# EAGLE design raspberry_pi2 (EAGLE 9.5.2)
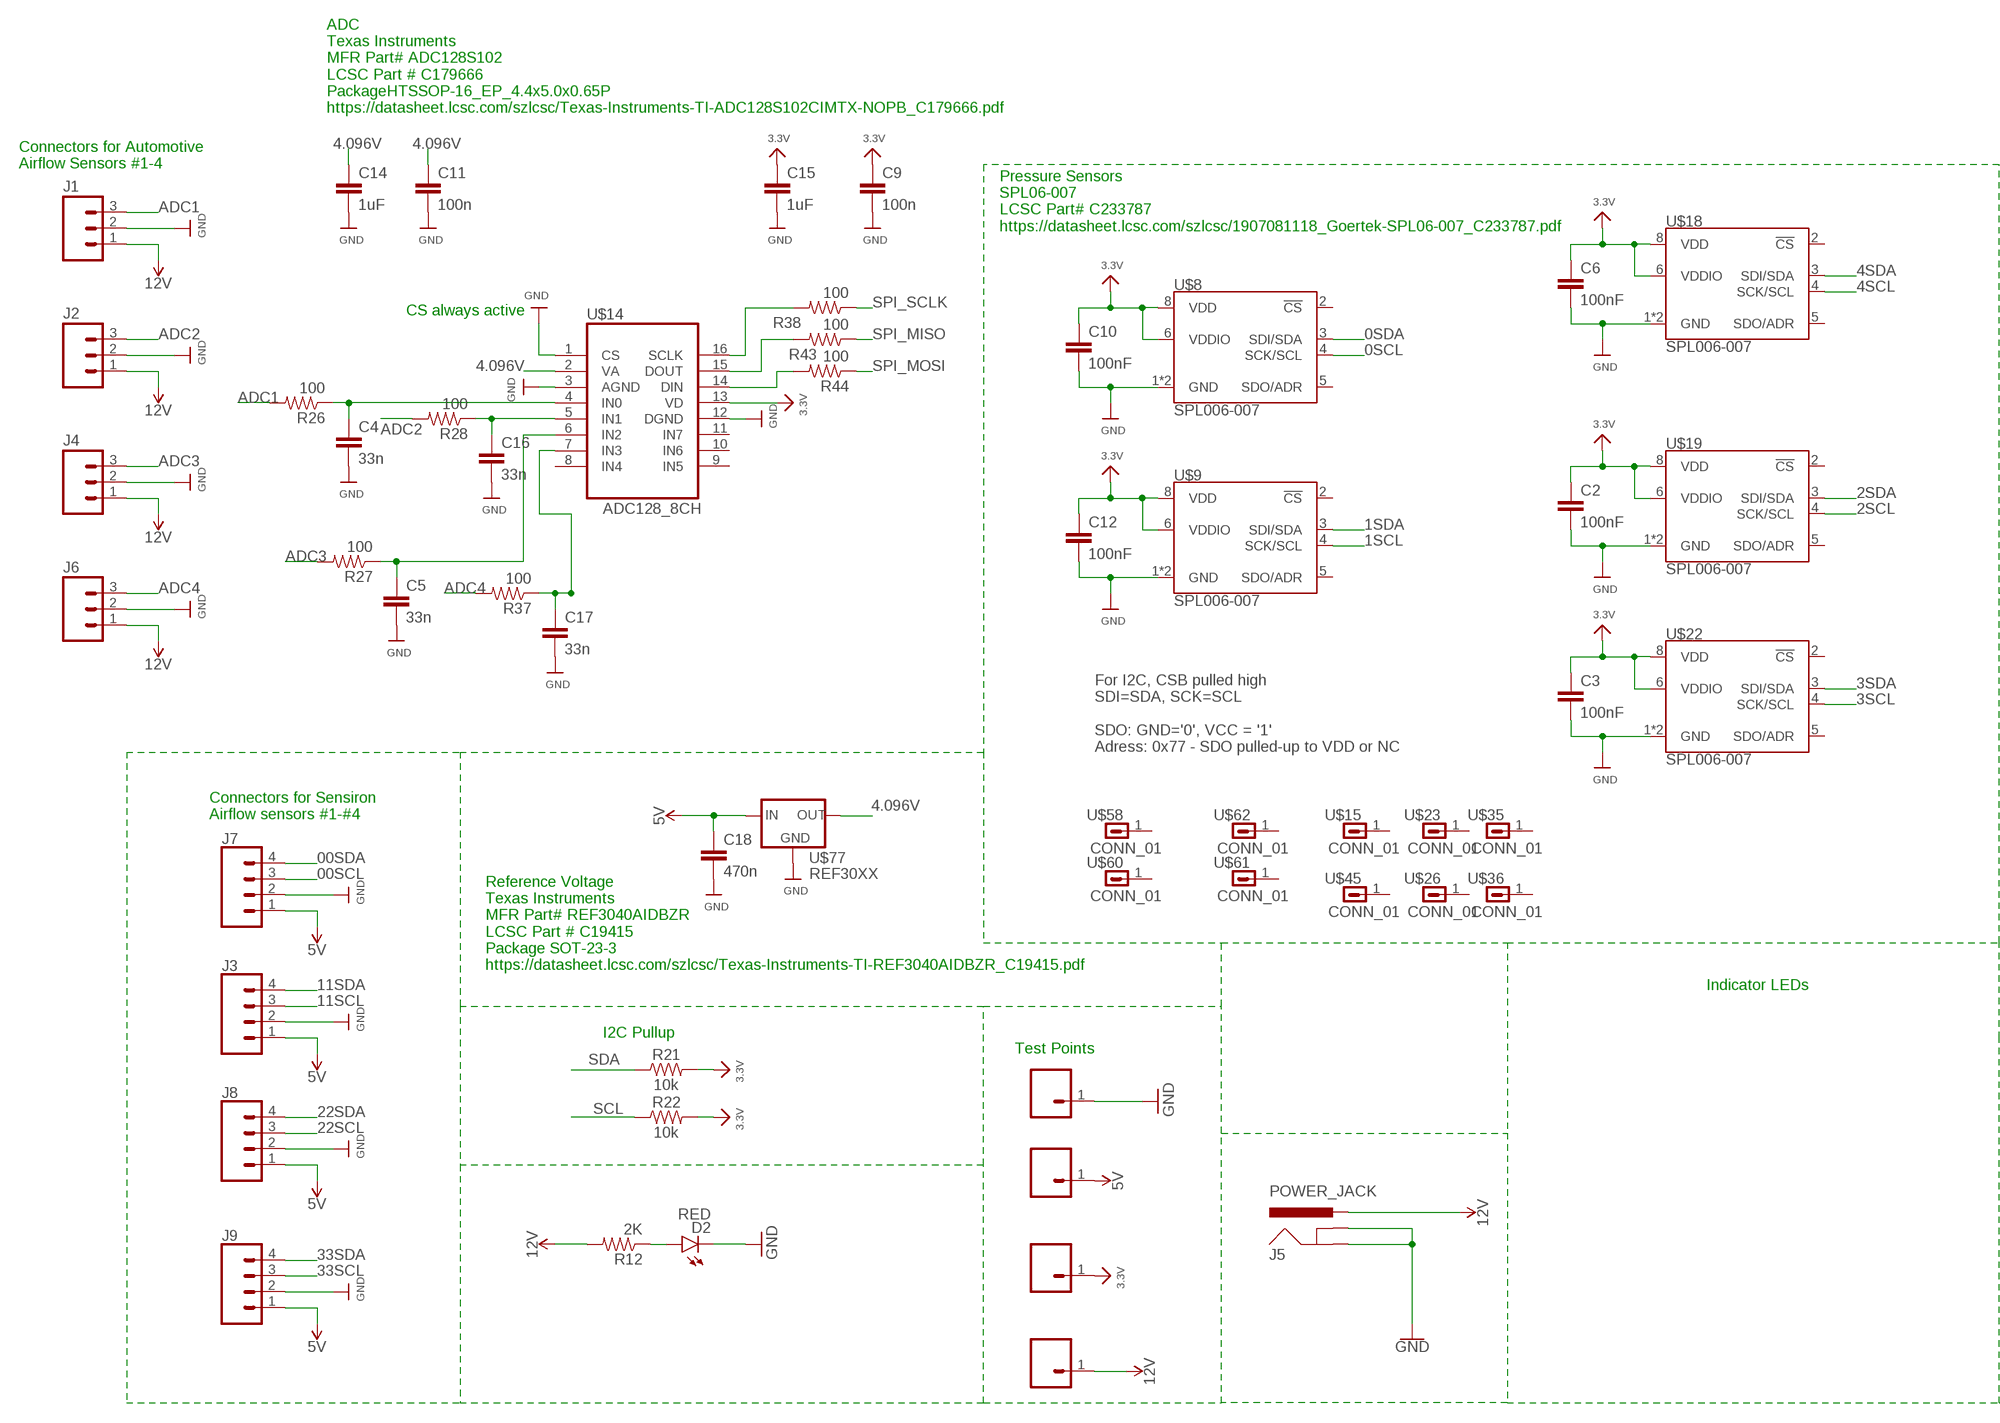
[diagram p0: schematic, sheet 1, part 1 of 2]
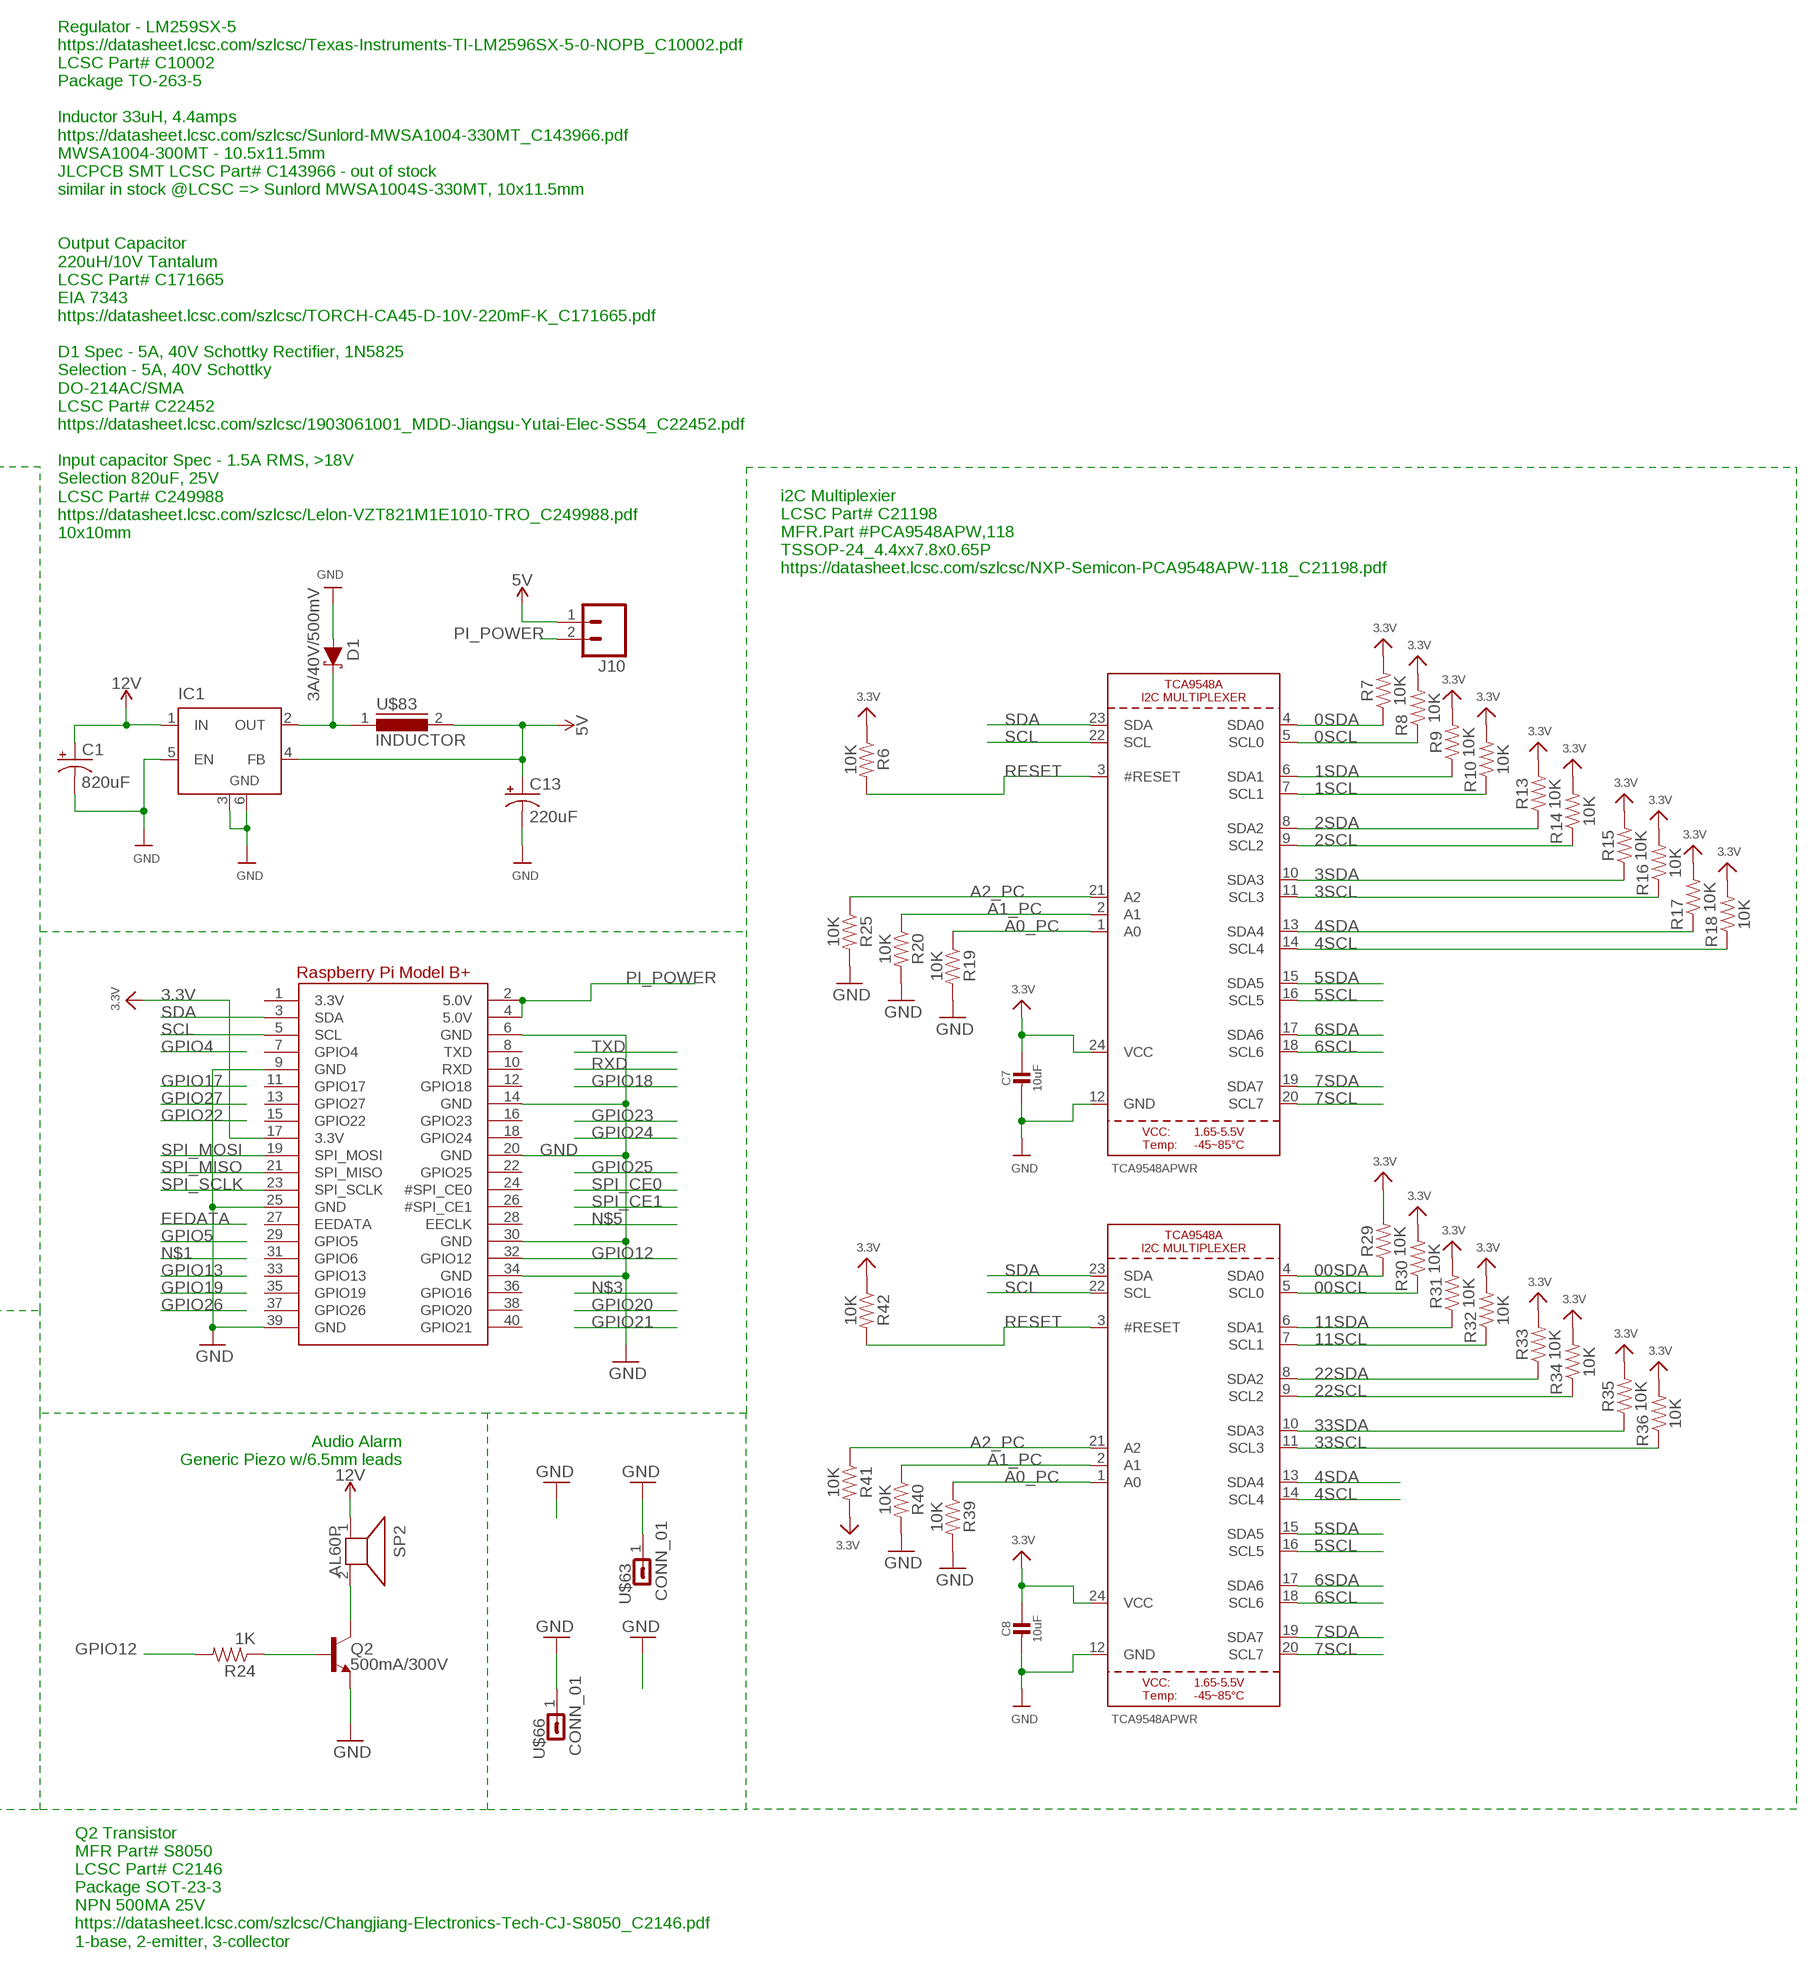
[diagram p1: schematic, sheet 1, part 2 of 2]

## Parts
C1  820uF  560UF-PANASONIC_G-25V-20%  [PANASONIC_G]
C2  100nF  CAP-0805  [0805]
C3  100nF  CAP-0805  [0805]
C4  33n  CAP-0805  [0805]
C5  33n  CAP-0805  [0805]
C6  100nF  CAP-0805  [0805]
C7  10uF  CAP_CERAMIC0805-NOOUTLINE  [0805-NO]
C8  10uF  CAP_CERAMIC0805-NOOUTLINE  [0805-NO]
C9  100n  CAP-0805  [0805]
C10  100nF  CAP-0805  [0805]
C11  100n  CAP-0805  [0805]
C12  100nF  CAP-0805  [0805]
C13  220uF  100UF-POLAR-EIA7343-10V-10%(TANT)  [EIA7343]
C14  1uF  CAP-0805  [0805]
C15  1uF  CAP-0805  [0805]
C16  33n  CAP-0805  [0805]
C17  33n  CAP-0805  [0805]
C18  470n  CAP-0805  [0805]
D1  3A/40V/500mV  DIODE-SCHOTTKY-B340A  [SMA-DIODE]
D2  RED  LED-RED1206  [LED-1206]
IC1  LM2596S  [TO263-5]
J1  M03SCREW  [SCREWTERMINAL-3.5MM-3]
J2  M03SCREW  [SCREWTERMINAL-3.5MM-3]
J3  CONN_043.5MM_RA  [1X04_3.5MM_RA]
J4  M03SCREW  [SCREWTERMINAL-3.5MM-3]
J5  POWER_JACK  [POWER_JACK_PTH]
J6  M03SCREW  [SCREWTERMINAL-3.5MM-3]
J7  CONN_043.5MM_RA  [1X04_3.5MM_RA]
J8  CONN_043.5MM_RA  [1X04_3.5MM_RA]
J9  CONN_043.5MM_RA  [1X04_3.5MM_RA]
J10  CONN_02  [1X02]
Q2  500mA/300V  TRANS_NPN-MMBTA42  [SOT23-3]
R6  10K  0.3OHM-0805-1/8W-1%  [0805]
R7  10K  0.3OHM-0805-1/8W-1%  [0805]
R8  10K  0.3OHM-0805-1/8W-1%  [0805]
R9  10K  0.3OHM-0805-1/8W-1%  [0805]
R10  10K  0.3OHM-0805-1/8W-1%  [0805]
R12  2K  RESISTOR0805-RES  [0805]
R13  10K  0.3OHM-0805-1/8W-1%  [0805]
R14  10K  0.3OHM-0805-1/8W-1%  [0805]
R15  10K  0.3OHM-0805-1/8W-1%  [0805]
R16  10K  0.3OHM-0805-1/8W-1%  [0805]
R17  10K  0.3OHM-0805-1/8W-1%  [0805]
R18  10K  0.3OHM-0805-1/8W-1%  [0805]
R19  10K  0.3OHM-0805-1/8W-1%  [0805]
R20  10K  0.3OHM-0805-1/8W-1%  [0805]
R21  10k  0.3OHM-0805-1/8W-1%  [0805]
R22  10k  0.3OHM-0805-1/8W-1%  [0805]
R24  1K  RESISTOR0805-RES  [0805]
R25  10K  0.3OHM-0805-1/8W-1%  [0805]
R26  100  RESISTOR0805-RES  [0805]
R27  100  RESISTOR0805-RES  [0805]
R28  100  RESISTOR0805-RES  [0805]
R29  10K  0.3OHM-0805-1/8W-1%  [0805]
R30  10K  0.3OHM-0805-1/8W-1%  [0805]
R31  10K  0.3OHM-0805-1/8W-1%  [0805]
R32  10K  0.3OHM-0805-1/8W-1%  [0805]
R33  10K  0.3OHM-0805-1/8W-1%  [0805]
R34  10K  0.3OHM-0805-1/8W-1%  [0805]
R35  10K  0.3OHM-0805-1/8W-1%  [0805]
R36  10K  0.3OHM-0805-1/8W-1%  [0805]
R37  100  RESISTOR0805-RES  [0805]
R38  100  RESISTOR0805-RES  [0805]
R39  10K  0.3OHM-0805-1/8W-1%  [0805]
R40  10K  0.3OHM-0805-1/8W-1%  [0805]
R41  10K  0.3OHM-0805-1/8W-1%  [0805]
R42  10K  0.3OHM-0805-1/8W-1%  [0805]
R43  100  RESISTOR0805-RES  [0805]
R44  100  RESISTOR0805-RES  [0805]
RPI1  MICROBUILDER_RASPBERRYPI_BPLUS_HATNOSLOTS_1  [MICROBUILDER_PI_HAT_NOSLOTS]
SP2  AL60P  [AL60P]
U6  TCA9548APWR  TCA9548A  [TSSOP24]
U7  TCA9548APWR  TCA9548A  [TSSOP24]
U$8  SPL006-007  [LGA-8-2.5X2.0]
U$9  SPL006-007  [LGA-8-2.5X2.0]
U$14  ADC128_8CH  [TSSOP16]
U$15  CONN_01  [1X01-#6_MACHINE]
U$18  SPL006-007  [LGA-8-2.5X2.0]
U$19  SPL006-007  [LGA-8-2.5X2.0]
U$20  CONN_0138MILL  [1X01-40MILL]
U$22  SPL006-007  [LGA-8-2.5X2.0]
U$23  CONN_01  [1X01-#6_MACHINE]
U$26  CONN_01  [1X01-#6_MACHINE]
U$31  CONN_0138MILL  [1X01-40MILL]
U$35  CONN_01  [1X01-#6_MACHINE]
U$36  CONN_01  [1X01-#6_MACHINE]
U$40  CONN_0138MILL  [1X01-40MILL]
U$45  CONN_01  [1X01-#6_MACHINE]
U$58  CONN_01  [1X01-#6_MACHINE]
U$59  CONN_0138MILL  [1X01-40MILL]
U$60  CONN_01  [1X01-#6_MACHINE]
U$61  CONN_01  [1X01-#6_MACHINE]
U$62  CONN_01  [1X01-#6_MACHINE]
U$63  CONN_01  [1X01-#6_MACHINE]
U$66  CONN_01  [1X01-#6_MACHINE]
U$77  REF30XX  [SOT23-3]
U$83  INDUCTOR  [INDUCTOR_10.5X11.5]

## Nets
0SCL: R8.1 U6.5(SCL0) U$8.4(SCK/SCL)
00SCL: J7.3 R30.1 U7.5(SCL0)
0SDA: R7.1 U6.4(SDA0) U$8.3(SDI/SDA)
00SDA: J7.4 R29.1 U7.4(SDA0)
1SCL: R10.1 U6.7(SCL1) U$9.4(SCK/SCL)
1SDA: R9.1 U6.6(SDA1) U$9.3(SDI/SDA)
2SCL: R14.1 U6.9(SCL2) U$19.4(SCK/SCL)
2SDA: R13.1 U6.8(SDA2) U$19.3(SDI/SDA)
3.3V: C2.1 C3.1 C6.1 C7.1 C8.1 C9.1 C10.1 C12.1 C15.1 R6.1 R7.2 R8.2 R9.2 R10.2 R13.2 R14.2 R15.2 R16.2 R17.2 R18.2 R21.2 R22.2 R29.2 R30.2 R31.2 R32.2 R33.2 R34.2 R35.2 R36.2 R41.2 R42.1 RPI1.17(3.3V) U6.24(VCC) U7.24(VCC) U$8.6(VDDIO) U$8.8(VDD) U$9.6(VDDIO) U$9.8(VDD) U$14.13(VD) U$18.6(VDDIO) U$18.8(VDD) U$19.6(VDDIO) U$19.8(VDD) U$20.1 U$22.6(VDDIO) U$22.8(VDD)
3SCL: R16.1 U6.11(SCL3) U$22.4(SCK/SCL)
3SDA: R15.1 U6.10(SDA3) U$22.3(SDI/SDA)
4.096V: C11.1 C14.1 U$14.2(VA) U$77.2(OUT)
4SCL: R18.1 U6.14(SCL4) U7.14(SCL4) U$18.4(SCK/SCL)
4SDA: R17.1 U6.13(SDA4) U7.13(SDA4) U$18.3(SDI/SDA)
5SCL: U6.16(SCL5) U7.16(SCL5)
5SDA: U6.15(SDA5) U7.15(SDA5)
5V: C13.A(+) C18.1 IC1.4(FB) J3.1 J7.1 J8.1 J9.1 J10.1 U$59.1 U$77.1(IN) U$83.2
6SCL: U6.18(SCL6) U7.18(SCL6)
6SDA: U6.17(SDA6) U7.17(SDA6)
7SCL: U6.20(SCL7) U7.20(SCL7)
7SDA: U6.19(SDA7) U7.19(SDA7)
11SCL: J3.3 R32.1 U7.7(SCL1)
11SDA: J3.4 R31.1 U7.6(SDA1)
12V: C1.+ IC1.1(IN) J1.1 J2.1 J4.1 J5.PWR J6.1 R12.2 SP2.1 U$40.1
22SCL: J8.3 R34.1 U7.9(SCL2)
22SDA: J8.4 R33.1 U7.8(SDA2)
33SCL: J9.3 R36.1 U7.11(SCL3)
33SDA: J9.4 R35.1 U7.10(SDA3)
A0_PC: R19.1 R39.1 U6.1(A0) U7.1(A0)
A1_PC: R20.1 R40.1 U6.2(A1) U7.2(A1)
A2_PC: R25.1 R41.1 U6.21(A2) U7.21(A2)
ADC1: J1.3 R26.2
ADC2: J2.3 R28.2
ADC3: J4.3 R27.2
ADC4: J6.3 R37.2
GND: C1.- C2.2 C3.2 C4.2 C5.2 C6.2 C7.2 C8.2 C9.2 C10.2 C11.2 C12.2 C13.C(-) C14.2 C15.2 C16.2 C17.2 C18.2 D1.A D2.C IC1.3(GND) IC1.5(EN) IC1.6(GND) J1.2 J2.2 J3.2 J4.2 J5.GND J5.GNDBREAK J6.2 J7.2 J8.2 J9.2 Q2.2(E) R19.2 R20.2 R25.2 R39.2 R40.2 RPI1.6(GND) RPI1.9(GND) RPI1.14(GND) RPI1.20(GND) RPI1.25(GND) RPI1.30(GND) RPI1.34(GND) RPI1.39(GND) U6.12(GND) U7.12(GND) U$8.1(GND) U$8.7(GND) U$9.1(GND) U$9.7(GND) U$14.1(CS) U$14.3(AGND) U$14.12(DGND) U$18.1(GND) U$18.7(GND) U$19.1(GND) U$19.7(GND) U$22.1(GND) U$22.7(GND) U$31.1 U$63.1 U$66.1 U$77.3(GND)
GPIO12: R24.2 RPI1.32(GPIO12)
N$2: D2.A R12.1
N$9: Q2.3(C) SP2.2
N$10: Q2.1(B) R24.1
N$18: C4.1 R26.1 U$14.4(IN0)
N$19: C5.1 R27.1 U$14.6(IN2)
N$20: C16.1 R28.1 U$14.5(IN1)
N$21: D1.C IC1.2(OUT) U$83.1
N$22: C17.1 R37.1 U$14.7(IN3)
N$23: R38.2 U$14.16(SCLK)
N$24: R43.2 U$14.15(DOUT)
N$25: R44.2 U$14.14(DIN)
PI_POWER: J10.2 RPI1.2(5.0V) RPI1.4(5.0V)
RESET: R6.2 R42.2 U6.3(#RESET) U7.3(#RESET)
SCL: R22.1 RPI1.5(SCL) U6.22(SCL) U7.22(SCL)
SDA: R21.1 RPI1.3(SDA) U6.23(SDA) U7.23(SDA)
SPI_MISO: R43.1 RPI1.21(SPI_MISO)
SPI_MOSI: R44.1 RPI1.19(SPI_MOSI)
SPI_SCLK: R38.1 RPI1.23(SPI_SCLK)
Unconnected: RPI1.1(3.3V) RPI1.7(GPIO4) RPI1.8(TXD) RPI1.10(RXD) RPI1.11(GPIO17) RPI1.12(GPIO18) RPI1.13(GPIO27) RPI1.15(GPIO22) RPI1.16(GPIO23) RPI1.18(GPIO24) RPI1.22(GPIO25) RPI1.24(#SPI_CE0) RPI1.26(#SPI_CE1) RPI1.27(EEDATA) RPI1.28(EECLK) RPI1.29(GPIO5) RPI1.31(GPIO6) RPI1.33(GPIO13) RPI1.35(GPIO19) RPI1.36(GPIO16) RPI1.37(GPIO26) RPI1.38(GPIO20) RPI1.40(GPIO21) U$8.2(!CS) U$8.5(SDO/ADR) U$9.2(!CS) U$9.5(SDO/ADR) U$14.8(IN4) U$14.9(IN5) U$14.10(IN6) U$14.11(IN7) U$15.1 U$18.2(!CS) U$18.5(SDO/ADR) U$19.2(!CS) U$19.5(SDO/ADR) U$22.2(!CS) U$22.5(SDO/ADR) U$23.1 U$26.1 U$35.1 U$36.1 U$45.1 U$58.1 U$60.1 U$61.1 U$62.1

## Notes on the sheet
- ADC
  Texas Instruments
  MFR Part# ADC128S102
  LCSC Part # C179666
  PackageHTSSOP-16_EP_4.4x5.0x0.65P
  https://datasheet.lcsc.com/szlcsc/Texas-Instruments-TI-ADC128S102CIMTX-NOPB_C179666.pdf
- Connectors for Automotive 
  Airflow Sensors #1-4
- Pressure Sensors
  SPL06-007
  LCSC Part# C233787
  https://datasheet.lcsc.com/szlcsc/1907081118_Goertek-SPL06-007_C233787.pdf
- Regulator - LM259SX-5
  https://datasheet.lcsc.com/szlcsc/Texas-Instruments-TI-LM2596SX-5-0-NOPB_C10002.pdf
  LCSC Part# C10002
  Package TO-263-5
  
  Inductor 33uH, 4.4amps
  https://datasheet.lcsc.com/szlcsc/Sunlord-MWSA1004-330MT_C143966.pdf
  MWSA1004-300MT - 10.5x11.5mm
  JLCPCB SMT LCSC Part# C143966 - out of stock
  similar in stock @LCSC => Sunlord MWSA1004S-330MT, 10x11.5mm
  
  
  Output Capacitor
  220uH/10V Tantalum
  LCSC Part# C171665
  EIA 7343
  https://datasheet.lcsc.com/szlcsc/TORCH-CA45-D-10V-220mF-K_C171665.pdf
  
  D1 Spec - 5A, 40V Schottky Rectifier, 1N5825
  Selection - 5A, 40V Schottky
  DO-214AC/SMA
  LCSC Part# C22452
  https://datasheet.lcsc.com/szlcsc/1903061001_MDD-Jiangsu-Yutai-Elec-SS54_C22452.pdf
  
  Input capacitor Spec - 1.5A RMS, >18V
  Selection 820uF, 25V
  LCSC Part# C249988
  https://datasheet.lcsc.com/szlcsc/Lelon-VZT821M1E1010-TRO_C249988.pdf
  10x10mm
- i2C Multiplexier
  LCSC Part# C21198
  MFR.Part #PCA9548APW,118
  TSSOP-24_4.4xx7.8x0.65P
  https://datasheet.lcsc.com/szlcsc/NXP-Semicon-PCA9548APW-118_C21198.pdf
- CS always active
- For I2C, CSB pulled high
  SDI=SDA, SCK=SCL
  
  SDO: GND='0', VCC = '1'
  Adress: 0x77 - SDO pulled-up to VDD or NC
- Connectors for Sensiron
  Airflow sensors #1-#4
- Reference Voltage
  Texas Instruments
  MFR Part# REF3040AIDBZR
  LCSC Part # C19415
  Package SOT-23-3
  https://datasheet.lcsc.com/szlcsc/Texas-Instruments-TI-REF3040AIDBZR_C19415.pdf
- Indicator LEDs
- I2C Pullup
- Test Points
- Audio Alarm
  Generic Piezo w/6.5mm leads
- Q2 Transistor
  MFR Part# S8050
  LCSC Part# C2146
  Package SOT-23-3
  NPN 500MA 25V
  https://datasheet.lcsc.com/szlcsc/Changjiang-Electronics-Tech-CJ-S8050_C2146.pdf
  1-base, 2-emitter, 3-collector

## Library data of the parts
C1 = SparkFun-Capacitors:560UF: 560µF polarized capacitors A capacitor is a passive two-terminal electrical component used to store electrical energy temporarily in an electric field.; PROD_ID: CAP-09983; VALUE: 560uF
C2-C6 C9-C12 C14-C18 = SparkFun-Capacitors:CAP
C7 C8 = microbuilder:CAP_CERAMIC: Ceramic Capacitors For new designs, use the packages preceded by an '_' character since they are more reliable: The following footprints should be used on most boards: _0402 - Standard footprint for regular board layouts _0603 - Standard footprint for regular board layouts _0805 - Standard footprint for regular board layouts _1206 - Standard footprint for regular board layouts For extremely tight-pitch boards where space is at a premium, the following 'micro-pitch' footprints can be used (smaller pads, no silkscreen outline, etc.): _0402MP - Micro-pitch footprint for very dense/compact boards _0603MP - Micro-pitch footprint for very dense/compact boards _0805MP - Micro-pitch footprint for very dense/compact boards _1206MP - Micro-pitch footprint for very dense/compact boards
C13 = th_libraries:100UF-POLAR: 100µF polarized capacitors A capacitor is a passive two-terminal electrical component used to store electrical energy temporarily in an electric field.; PROD_ID: CAP-07890; VALUE: 100uF
D1 = SparkFun-DiscreteSemi:DIODE-SCHOTTKY: Schottky diode A Schottky diode is a semiconductor diode which has a low forward voltage drop and a very fast switching action.; PROD_ID: DIO-09886
D2 = SparkFun-LED:LED-RED: Red SMD LED Used in manufacturing of most products at SparkFun Packages: 0603 - SMD 0603 package [Product Link] <http://docs.avagotech.com/docs/AV02-0551EN> 0603 SMART - SMD 0603 SMART package ( more efficient and expensive)[Product Link] <http://www.osram-os.com/Graphics/XPic2/00077099_0.pdf> 1206 - SMD1206 package [Product Link] <https://www.sparkfun.com/datasheets/DevTools/LilyPad/Q150OVS4.pdff> SparkFun Products: Pro Mini 328 -5V <https://www.sparkfun.com/products/821> RedBoard <https://www.sparkfun.com/products/12757> IOIO-OTG <https://www.sparkfun.com/products/13613>; PROD_ID: DIO-09912
IC1 = linear:LM2596S: STEP-DOWN VOLTAGE REGULATOR
J1 J2 J4 J6 = SparkFun-Connectors:M03: Header 3 Standard 3-pin 0.1" header. Use with straight break away headers (SKU : PRT-00116), right angle break away headers (PRT-00553), swiss pins (PRT-00743), machine pins (PRT-00117), and female headers (PRT-00115). Molex polarized connector foot print use with SKU : PRT-08232 with associated crimp pins and housings.; PROD_ID: CONN-08288
J3 J7-J9 = th_libraries:CONN_04: Multi connection point. Often used as Generic Header-pin footprint for 0.1 inch spaced/style header connections On any of the 0.1 inch spaced packages, you can populate with these: Break Away Headers - Straight <https://www.sparkfun.com/products/116> (PRT-00116) Break Away Male Headers - Right Angle <https://www.sparkfun.com/products/553> (PRT-00553) Female Headers <https://www.sparkfun.com/products/115> (PRT-00115) Break Away Headers - Machine Pin <https://www.sparkfun.com/products/117> (PRT-00117) Break Away Female Headers - Swiss Machine Pin <https://www.sparkfun.com/products/743> (PRT-00743) For SCREWTERMINALS and SPRING TERMINALS visit here: Screw Terimnals on SparkFun.com <https://www.sparkfun.com/search/results?term=Screw+Terminals> (5mm/3.5mm/2.54mm spacing) This device is also useful as a general connection point to wire up your design to another part of your project. Our various solder wires solder well into these plated through hole pads. Hook-Up Wire - Assortment (Stranded, 22 AWG) <https://www.sparkfun.com/products/11375> (PRT-11375) Hook-Up Wire - Assortment (Solid Core, 22 AWG) <https://www.sparkfun.com/products/11367> (PRT-11367) View the entire wire category on our website here <https://www.sparkfun.com/categories/141> Special notes: Molex polarized connector foot print use with SKU : PRT-08231 with associated crimp pins and housings. 1MM SMD Version SKU: PRT-10208
J5 = SparkFun-Connectors:POWER_JACK: Power Jack Connector This is the standard 5.5mm barrel jack for power. The PTH is the most common, proven, reliable, footprint. The Slot footprint only works if the mill layer is transmitted to the PCB fab house so be warned. Here are the connectors we sell at SparkFun: DC Barrel Power Jack/Connector <https://www.sparkfun.com/products/119> (PRT-00119) DC Barrel Power Jack/Connector (SMD) <https://www.sparkfun.com/products/12748> (PRT-12748) DC Barrel Jack Adapter - Breadboard Compatible <https://www.sparkfun.com/products/10811> (PRT-10811) It is used on this SparkFun product (and many, many others): SparkFun RedBoard - Programmed with Arduino <https://www.sparkfun.com/products/12757> (DEV-12757) Also, if you need a mating power supply or connector, please check these out: Wall Adapter Power Supply - 9VDC 650mA <https://www.sparkfun.com/products/298> (TOL-00298) DC Barrel Jack Adapter - Male <https://www.sparkfun.com/products/10287> (PRT-10287); PROD_ID: CONN-08197
J10 = SparkFun-Connectors:CONN_02: Multi connection point. Often used as Generic Header-pin footprint for 0.1 inch spaced/style header connections On any of the 0.1 inch spaced packages, you can populate with these: Break Away Headers - Straight <https://www.sparkfun.com/products/116> (PRT-00116) Break Away Male Headers - Right Angle <https://www.sparkfun.com/products/553> (PRT-00553) Female Headers <https://www.sparkfun.com/products/115> (PRT-00115) Break Away Headers - Machine Pin <https://www.sparkfun.com/products/117> (PRT-00117) Break Away Female Headers - Swiss Machine Pin <https://www.sparkfun.com/products/743> (PRT-00743) For SCREWTERMINALS and SPRING TERMINALS visit here: Screw Terimnals on SparkFun.com <https://www.sparkfun.com/search/results?term=Screw+Terminals> (5mm/3.5mm/2.54mm spacing) This device is also useful as a general connection point to wire up your design to another part of your project. Our various solder wires solder well into these plated through hole pads. Hook-Up Wire - Assortment (Stranded, 22 AWG) <https://www.sparkfun.com/products/11375> (PRT-11375) Hook-Up Wire - Assortment (Solid Core, 22 AWG) <https://www.sparkfun.com/products/11367> (PRT-11367) View the entire wire category on our website here <https://www.sparkfun.com/categories/141> Special notes: Molex polarized connector foot print use with: PRT-08233 with associated crimp pins and housings. 2.54_SCREWTERM for use with PRT-10571. 3.5mm Screw Terminal footprints for PRT-08084 5mm Screw Terminal footprints for use with PRT-08432
Q2 = SparkFun-DiscreteSemi:TRANS_NPN: NPN transistor Current controlled devices typically used to amplify current or used as a switch. BC547 - COM-08928 <http://www.sparkfun.com/products/8928> (TO-92 45V 100mA) (1.Collector 2.Base 3.Emitter) 2N3904 - COM-00521 <http://www.sparkfun.com/products/521> (TO-92 40V 200mA) (1.Emitter 2.Base 3.Collector) P2N2222A - COM-12852 <http://www.sparkfun.com/products/12852> (TO-92 40V 600mA) (1.Collector 2.Base 3.Emitter); PROD_ID: TRANS-09116
R6-R10 R13-R22 R25 R29-R36 R39-R42 = SparkFun-Resistors:0.3OHM: 0.3Ω resistor A resistor is a passive two-terminal electrical component that implements electrical resistance as a circuit element. Resistors act to reduce current flow, and, at the same time, act to lower voltage levels within circuits. - Wikipedia; PROD_ID: RES-11622; VALUE: 0.3
R12 R24 R26-R28 R37 R38 R43 R44 = SparkFun-Passives:RESISTOR: Resistor Basic schematic elements and footprints for 0603, 1206, and PTH resistors.
RPI1 = Adafruit HaD Proto HAT rev A_temp:MICROBUILDER_RASPBERRYPI_BPLUS
SP2 = buzzer:AL60P: SPEAKER Source: Buerklin; OC_FARNELL: unknown; OC_NEWARK: unknown
U6 U7 = microbuilder:TCA9548A: TCA9548A I2C Multiplexer
U$8 U$9 U$18 U$19 U$22 = th_libraries:SPL006-007: Goertek SPL06-007 – Combined Humidity and Pressure Sensor The SPL06-007 is as combined digital humidity, pressure and temperature sensor.. The sensor module is housed in an extremely compact metal-lid LGA package with a footprint of only 2.5×2.0mm² with a height of 0.95mm. . Datasheet <https://datasheet.lcsc.com/szlcsc/1907081118_Goertek-SPL06-007_C233787.pdf>
U$14 = th_libraries:ADC128_8CH: ADC128S102 12-bit, 8 Channel ADC http://www.ti.com/lit/ds/symlink/adc128s102.pdf?HQS=TI-null-null-digikeymode-df-pf-null-wwe&ts=1591294747607 https://www.digikey.com/product-detail/en/texas-instruments/ADC128S102CIMTX-NOPB/296-41184-1-ND/5222639
U$15 U$23 U$26 U$35 U$36 U$45 U$58 U$60-U$63 U$66 = th_libraries:CONN_01: #6 Machine Screw tite - 144mil hole, 256mil diameter
U$20 U$31 U$40 U$59 = th_libraries3:CONN_01: #6 Machine Screw tite - 144mil hole, 256mil diameter
U$77 = th_libraries:REF30XX: Voltage Reference REF3012 - 1.25V REF3020 - 2.048V REF3025 - 2.5V REF3030 - 3.0V REF3033 - 3.3V REF3040 - 4.096V REF3040AIDBZR https://www.digikey.com/product-detail/en/texas-instruments/REF3040AIDBZR/296-35920-1-ND/4135041
U$83 = th_libraries:INDUCTOR

## Net classes
1 highpower: width 0.305 mm, drill 0.483 mm
2 lowpower: width 0.305 mm, drill 0.483 mm

## Board
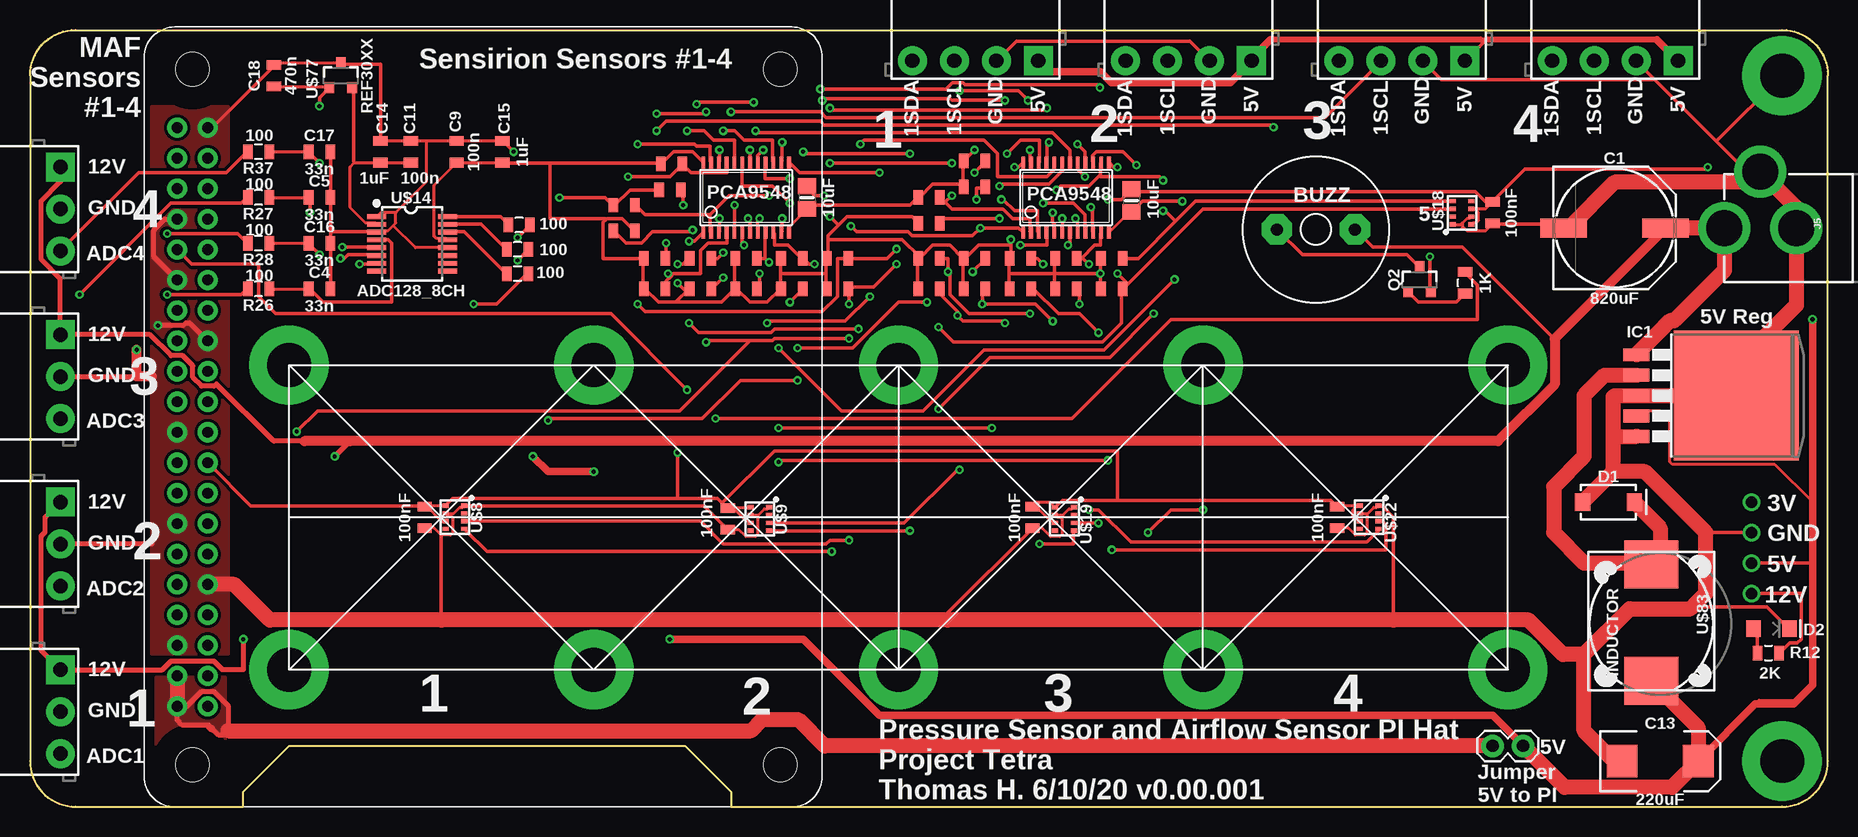
[diagram p2: board, top side]
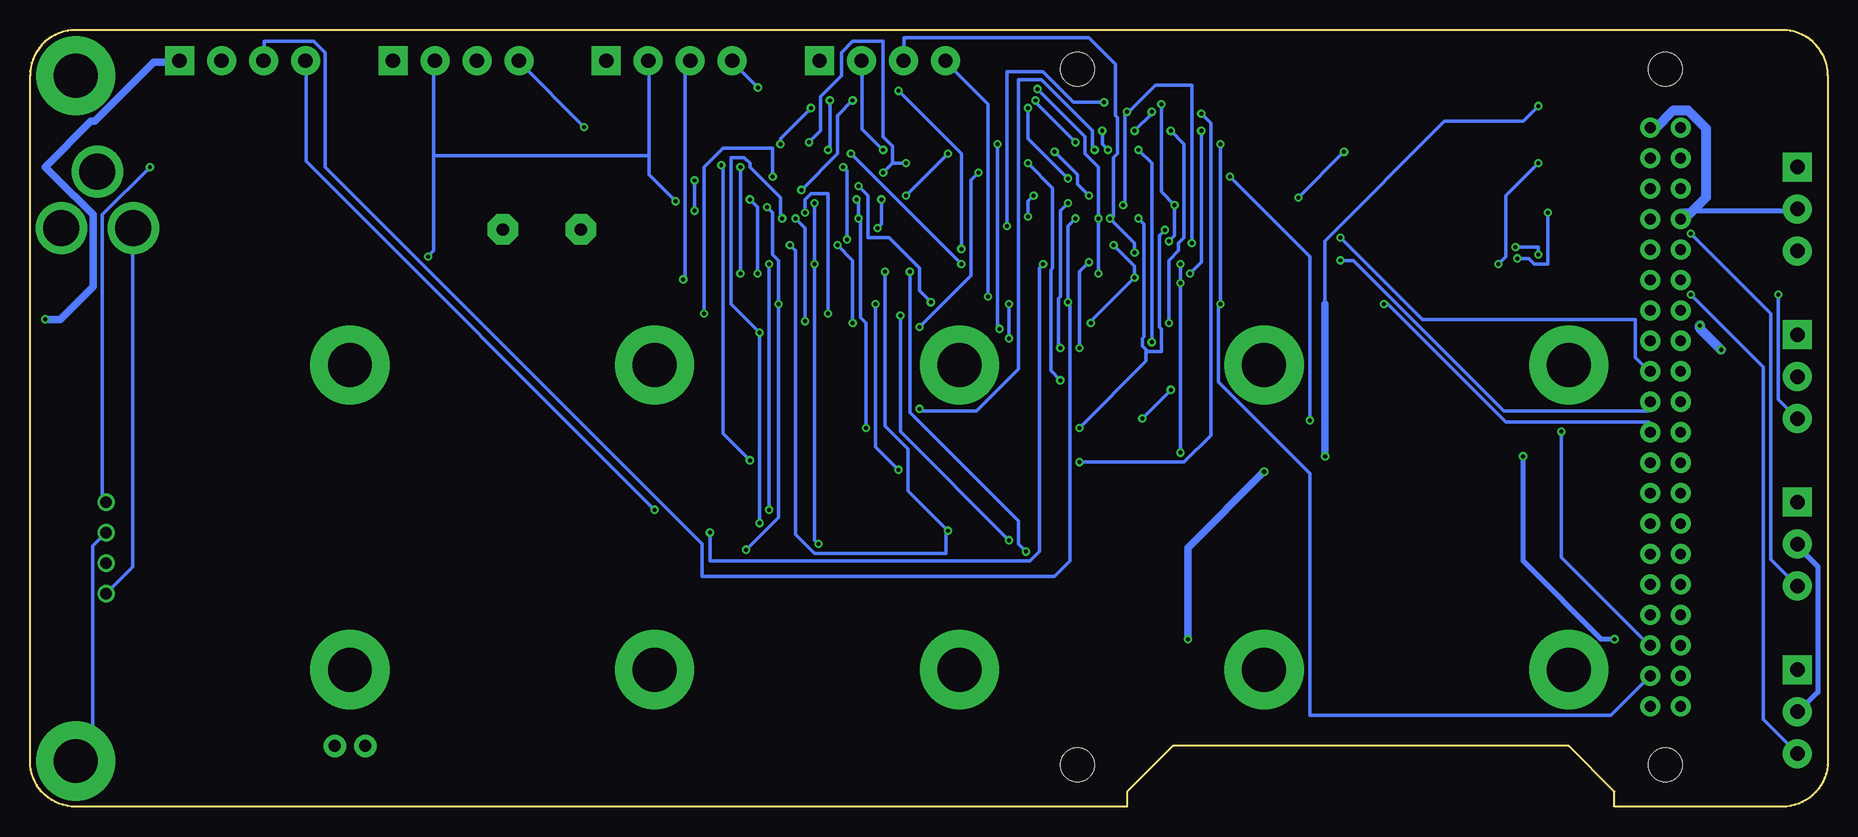
[diagram p3: board, bottom side, seen from below]

Size 149.86 x 64.77 mm. Coordinates in mm from the lower left corner, seen from the top.
Outline: 0,60.96 0,3.81 arc90 3.81,0 17.78,0 17.78,1.27 21.59,5.08 54.61,5.08 58.42,1.27 58.42,0 146.05,0 arc90 149.86,3.81 149.86,60.96 arc90 146.05,64.77 3.81,64.77 arc90 0,60.96
Copper layers (1*16): Top 0.0356mm / dielectric 1.5011mm / Bottom 0.0356mm
Design rules "LaenPCBOrder *": minimum track width 12mil, minimum drill 13mil, track to track 8mil, track to pad 8mil, pad to pad 8mil, via to via 8mil, smd to smd 6mil, copper to edge 15mil, drill to drill 6mil, minimum pad ring 7mil, minimum via ring 7mil, stop-mask expansion 3mil, vias tented up to drill 25mil, thermal gap 10mil

### Footprints (pad centres in the part's own frame; a part is rotated, then mirrored left to right if it is on the bottom)
PANASONIC_G = smd 3.9 x 1.6: + 4.25,0; - -4.25,0
0805 = smd 0.8 x 1.2: 1 -0.9,0; 2 0.9,0
0805-NO = smd 1.3 x 1.5: 1 -0.95,0; 2 0.95,0
EIA7343 = smd 2.55 x 2.7: A 3.17,0; C -3.17,0
SMA-DIODE = smd 1.27 x 1.47: A -2.15,0; C 2.15,0
LED-1206 = smd 1.2 x 1.4: A -1.5,0; C 1.5,0
TO263-5 = smd 1.067 x 2.159: 1 -3.404,-5.791; 2 -1.702,-5.791; 3 0,-5.791; 4 1.702,-5.791; 5 3.404,-5.791 | smd 10.8 x 10.41: 6 0,2.54
SCREWTERMINAL-3.5MM-3 = drill 1.2 pad 2.413 square: 1 0,0 | drill 1.2 pad 2.413: 2 3.5,0; 3 7,0
1X04_3.5MM_RA = drill 1.2 pad 2.413 square: 1 -0.228,0.023 | drill 1.2 pad 2.413: 2 3.272,0.023; 3 6.772,0.023; 4 10.272,0.023
POWER_JACK_PTH = drill 2.997 pad 4.318: GND 0,7.7; GNDBREAK 4.7,10.7; PWR 0,13.7
1X02 = drill 1.016 pad 1.88: 1 0,0; 2 2.54,0
SOT23-3 = smd 0.8 x 0.9: 1 -0.95,-1; 2 0.95,-1; 3 0,1.1
MICROBUILDER_PI_HAT_NOSLOTS = drill 0.9 pad 1.676: 1 8.37,51.23; 2 8.37,53.77; 3 10.91,51.23; 4 10.91,53.77; 5 13.45,51.23; 6 13.45,53.77; 7 15.99,51.23; 8 15.99,53.77; 9 18.53,51.23; 10 18.53,53.77; 11 21.07,51.23; 12 21.07,53.77; 13 23.61,51.23; 14 23.61,53.77; 15 26.15,51.23; 16 26.15,53.77; 17 28.69,51.23; 18 28.69,53.77; 19 31.23,51.23; 20 31.23,53.77; 21 33.77,51.23; 22 33.77,53.77; 23 36.31,51.23; 24 36.31,53.77; 25 38.85,51.23; 26 38.85,53.77; 27 41.39,51.23; 28 41.39,53.77; 29 43.93,51.23; 30 43.93,53.77; 31 46.47,51.23; 32 46.47,53.77; 33 49.01,51.23; 34 49.01,53.77; 35 51.55,51.23; 36 51.55,53.77; 37 54.09,51.23; 38 54.09,53.77; 39 56.63,51.23; 40 56.63,53.77 | hole 2.8: 3.5,3.5; 3.5,52.5; 61.5,52.5; 61.5,3.5
AL60P = drill 1.016 pad 2.54 octagon: 1 -3.251,0; 2 3.251,0
TSSOP24 = smd 0.305 x 0.991: 1 -3.575,-2.918; 2 -2.925,-2.918; 3 -2.275,-2.918; 4 -1.625,-2.918; 5 -0.975,-2.918; 6 -0.325,-2.918; 7 0.325,-2.918; 8 0.975,-2.918; 9 1.625,-2.918; 10 2.275,-2.918; 11 2.925,-2.918; 12 3.575,-2.918; 13 3.575,2.918; 14 2.925,2.918; 15 2.275,2.918; 16 1.625,2.918; 17 0.975,2.918; 18 0.325,2.918; 19 -0.325,2.918; 20 -0.975,2.918; 21 -1.625,2.918; 22 -2.275,2.918; 23 -2.925,2.918; 24 -3.575,2.918
LGA-8-2.5X2.0 = smd 0.5 x 0.35: 1 0.771,0.975; 2 0.771,0.325; 3 0.771,-0.325; 4 0.771,-0.975; 5 -0.779,-0.975; 6 -0.779,-0.325; 7 -0.779,0.325; 8 -0.779,0.975
TSSOP16 = smd 0.4 x 1.6: 1 -2.225,-2.85; 2 -1.575,-2.85; 3 -0.925,-2.85; 4 -0.275,-2.85; 5 0.375,-2.85; 6 1.025,-2.85; 7 1.675,-2.85; 8 2.325,-2.85; 9 2.325,3.05; 10 1.675,3.05; 11 1.025,3.05; 12 0.375,3.05; 13 -0.275,3.05; 14 -0.925,3.05; 15 -1.575,3.05; 16 -2.225,3.05
1X01-#6_MACHINE = drill 3.658 pad 6.604: 1 0,0
1X01-40MILL = drill 0.965 pad 1.397: 1 0,0
INDUCTOR_10.5X11.5 = smd 4 x 4.5: 1 -4.975,-0.75; 2 4.725,-0.75

### Placement (x,y rotation side)
C1  132.08,48.26 0 top
C2  83.57,24.13 270 top
C3  108.97,24.13 270 top
C4  24.13,43.18 0 top
C5  24.13,50.8 0 top
C6  121.92,49.53 270 top
C7  91.82,50.55 270 top
C8  64.77,50.8 270 top
C9  35.56,54.61 90 top
C10  32.89,24.13 270 top
C11  31.75,54.61 90 top
C12  58.17,24 270 top
C13  135.89,3.81 0 top
C14  29.21,54.61 90 top
C15  39.37,54.61 90 top
C16  24.13,46.99 0 top
C17  24.13,54.61 0 top
C18  20.32,60.96 90 top
D1  131.57,25.4 0 top
D2  145.16,14.86 0 top
IC1  139.7,34.29 270 top
J1  2.54,11.43 270 top
J2  2.54,25.4 270 top
J3  83.82,62.23 180 top
J4  2.54,39.37 270 top
J5  154.94,48.26 90 top
J6  2.54,53.34 270 top
J7  119.38,62.23 180 top
J8  101.6,62.23 180 top
J9  137.16,62.23 180 top
J10  124.46,5.08 180 top
Q2  115.82,43.94 0 top
R6  74.93,48.64 0 top
R7  74.93,43.18 180 top
R8  74.93,45.72 180 top
R9  78.74,43.18 180 top
R10  78.74,45.72 180 top
R12  144.91,12.83 0 top
R13  82.55,43.18 180 top
R14  82.55,45.72 180 top
R15  86.36,43.18 180 top
R16  86.36,45.72 180 top
R17  90.17,43.18 180 top
R18  90.17,45.72 180 top
R19  78.74,51.69 180 top
R20  74.93,50.8 180 top
R21  67.31,45.72 180 top
R22  67.31,43.18 180 top
R24  119.63,43.69 90 top
R25  78.74,53.85 180 top
R26  19.05,43.18 180 top
R27  19.05,50.8 180 top
R28  19.05,46.99 180 top
R29  52.07,43.18 180 top
R30  52.07,45.72 180 top
R31  55.88,43.18 180 top
R32  55.88,45.72 180 top
R33  59.69,43.18 180 top
R34  59.69,45.72 180 top
R35  63.5,45.72 180 top
R36  63.5,43.18 180 top
R37  19.05,54.61 180 top
R38  40.77,48.51 180 top
R39  53.34,51.44 180 top
R40  49.53,50.16 180 top
R41  53.47,53.59 180 top
R42  49.53,48.01 180 top
R43  40.64,46.48 180 top
R44  40.64,44.45 180 top
RPI1  66.04,0 90 top
SP2  107.19,48.13 180 top
U6  86.36,50.8 0 top
U7  59.69,50.8 0 top
U$8  35.43,24.13 0 top
U$9  60.83,24 0 top
U$14  31.75,46.99 270 top
U$15  46.99,36.83 0 top
U$18  119.38,49.53 180 top
U$19  86.23,24 0 top
U$20  143.51,25.4 270 top
U$22  111.63,24.13 0 top
U$23  21.59,11.43 0 top
U$26  123.19,36.83 0 top
U$31  143.51,22.86 270 top
U$35  21.59,36.83 0 top
U$36  123.19,11.43 0 top
U$40  143.51,17.78 270 top
U$45  46.99,11.43 0 top
U$58  97.79,36.83 0 top
U$59  143.51,20.32 0 top
U$60  97.79,11.43 0 top
U$61  72.39,36.83 0 top
U$62  72.39,11.43 0 top
U$63  146.05,3.81 0 top
U$66  146.05,60.96 270 top
U$77  25.91,60.96 0 top
U$83  135.89,15.24 270 top

### Tracks (layer width: path | path; a pad name or v marks a point on that pad's centre or on a via)
0SCL  (via drill 0.33)
  Top 0.305: v66.83,21.27 38.1,21.27 36.35,23.02 U$8.4 | R8.1 76.52,45.72 v76.52,44.61 76.68,44.61 76.68,42.7 78.26,41.12 v83.34,41.12 | v85.25,49.53 85.25,48.74 85.41,48.58 85.41,47.94 U6.5
  Bottom 0.305: v66.83,21.27 67.47,21.91 67.47,23.81 76.52,32.86 v76.52,44.61 | v85.25,49.53 85.25,50.64 84.77,51.12 83.34,51.12 v83.34,41.12
00SCL  (via drill 0.33)
  Top 0.305: v58.74,50.16 58.74,47.94 U7.5 | v53.02,46.99 53.02,45.72 R30.1 | v58.42,57.94 65.88,57.94 66.36,57.47 107.95,57.47 112.55,62.07 J7.3
  Bottom 0.305: v58.74,50.16 58.58,50.32 58.58,57.63 58.34,57.86 | 58.34,57.86 56.04,60.17 53.02,60.17 v53.02,46.99 | v58.42,57.94 58.34,57.86
0SDA  (via drill 0.33)
  Top 0.305: v68.26,22.23 66.68,22.23 66.36,21.91 57.79,21.91 55.88,23.81 36.35,23.81 U$8.3 | R7.1 75.88,43.18 75.88,42.7 77.31,41.27 v77.31,40.96 77.79,40.48 81.12,40.48 v81.28,40.32 | v82.55,46.83 84.77,46.83 84.77,47.78 U6.4
  Bottom 0.305: v68.26,22.23 77.31,31.27 v77.31,40.96 | v82.55,46.83 81.28,45.56 v81.28,40.32
00SDA  (via drill 0.33)
  Top 0.305: 53.42,44.21 53.02,43.81 53.02,43.18 R29.1 | 53.42,44.21 53.66,44.45 55.88,44.45 55.88,46.35 56.52,46.99 58.1,46.99 58.1,47.78 U7.4 | v53.18,44.45 53.42,44.21 | v52.23,56.36 53.02,57.15 65.88,57.15 66.2,56.83 103.5,56.83 v103.66,56.67
  Bottom 0.305: v53.18,44.45 52.23,45.4 v52.23,56.36 | v103.66,56.67 109.06,62.07 J7.4
1SCL  (via drill 0.33)
  Top 0.305: v73.34,23.02 61.75,23.02 U$9.4 | v78.58,44.61 79.69,45.72 R10.1 | v86.52,46.83 86.68,46.83 86.68,47.78 U6.7
  Bottom 0.305: v78.58,44.61 78.58,31.75 76.68,29.84 76.68,26.35 v73.34,23.02 73.5,23.02 73.5,21.11 84.45,21.11 86.04,22.7 86.04,46.35 v86.52,46.83
1SDA  (via drill 0.33)
  Top 0.305: v77.47,28.1 77.31,28.1 72.87,23.65 61.75,23.65 U$9.3 | R9.1 79.38,43.18 v79.38,41.91 83.82,41.91 v85.25,40.48 | v86.04,49.05 86.04,47.94 U6.6
  Bottom 0.305: v77.47,28.1 79.38,30 v79.38,41.91 | v86.04,49.05 85.25,48.26 v85.25,40.48
2SCL  (via drill 0.33)
  Top 0.305: v84.14,21.91 87,21.91 87,23.02 U$19.4 | v84.45,45.24 83.98,45.72 R14.1 | v84.45,50.32 87,50.32 87.95,49.37 87.95,47.94 U6.9
  Bottom 0.305: v84.14,21.91 84.45,22.23 v84.45,45.24 v84.45,50.32
2SDA  (via drill 0.33)
  Top 0.305: v89.06,23.65 87.15,23.65 U$19.3 | v89.06,39.53 87.47,41.12 85.72,41.12 83.66,43.18 R13.1 | v87.15,49.05 87.31,49.05 87.31,47.94 U6.8
  Bottom 0.305: v89.06,23.65 v89.06,39.53 91.44,41.91 91.44,54.13 90.33,54.13 89.85,53.66 89.85,53.34 87.31,50.8 87.31,49.21 v87.15,49.05
3.3V  (via drill 0.33)
  Top 0.254: U$14.13 34.68,47.38 33.86,47.38 33.67,47.58 33.67,51.82 C9.1 C15.1 | U$18.6 120.65,49.85 | 120.65,49.85 121.34,49.85 C6.1 | U$18.8 120.3,48.7 120.55,48.7 120.74,48.89 120.74,49.52 120.65,49.61 120.65,49.85 | C3.1 109.04,25.1 110.49,25.1 | 110.49,25.1 U$22.8 | U$22.6 110.71,23.95 110.47,23.95 110.27,24.14 110.27,24.77 110.49,24.98 110.49,25.1 | U$19.6 85.31,23.82 85.07,23.82 83.82,25.07 | 83.82,25.07 83.82,25.4 85.03,25.4 U$19.8 | C2.1 83.78,25.03 83.82,25.07 | U$9.8 58.24,24.98 C12.1 58.59,24.9 59.67,23.82 59.91,23.82 U$9.6 | C10.1 32.97,25.1 33.02,25.1 | 33.02,25.1 U$8.8 | U$8.6 34.32,23.8 33.02,25.1
  Top 0.305: v139.86,53.34 139.7,53.18 124.62,53.18 121.92,50.48 C6.1 121.6,50.16 120.49,51.28 92.08,51.28 91.92,51.44 C7.1 91.76,51.44 90.96,50.64 v89.85,50.64 | R7.2 73.98,43.18 73.98,45.72 R8.2 | 77.79,45.72 77.79,43.18 R9.2 | 77.79,45.72 76.68,46.83 75.25,46.83 74.14,45.72 R8.2 | 77.79,45.72 R10.2 77.95,45.72 79.06,46.83 81.76,46.83 | v89.22,44.45 89.22,45.72 R18.2 | v89.22,44.45 89.22,43.18 R17.2 | 85.41,44.45 85.41,45.72 R16.2 | 85.41,44.45 85.41,43.18 R15.2 | v82.07,53.34 82.39,53.34 82.71,53.66 U6.24 | 81.76,46.83 81.76,45.72 R14.2 81.6,45.72 81.6,44.45 | 81.76,46.83 v81.76,47.31 | 81.6,44.45 81.6,43.18 R13.2 | 81.6,44.45 85.41,44.45 | 85.41,44.45 v89.22,44.45 | U7.24 56.04,53.82 55.25,54.61 53.66,54.61 52.7,53.66 R41.2 52.55,53.66 43.34,53.66 | 43.34,53.66 39.37,53.66 C15.1 | 58.74,43.18 58.74,45.72 R34.2 | 51.12,45.72 51.12,43.18 R29.2 51.28,43.18 52.39,42.07 53.82,42.07 53.9,42.15 | 53.9,42.15 54.93,43.18 R31.2 54.61,43.02 v53.98,43.66 | v53.98,45.24 54.45,45.24 54.93,45.72 R32.2 | 48.02,48.97 47.78,48.74 47.78,45.72 51.12,45.72 | 48.02,48.97 48.1,49.05 49.37,49.05 50.32,48.1 R42.1 | 51.12,45.72 R30.2 | 58.74,43.18 57.63,42.07 53.98,42.07 53.9,42.15 | 58.74,43.18 R33.2 58.9,43.18 60.01,42.07 61.44,42.07 62.55,43.18 | 62.55,44.45 62.55,45.72 R35.2 | 62.55,44.45 62.55,43.18 | 66.36,44.45 66.36,45.72 R21.2 66.52,45.72 66.52,47.31 | 66.36,44.45 66.36,43.18 R22.2 | 67.39,48.5 66.52,47.62 66.52,47.31 | 67.39,48.5 68.1,49.21 73.5,49.21 73.98,48.74 R6.1 | v66.2,50.96 65.41,50.96 64.77,51.59 C8.1 | 67.39,48.5 v66.68,49.21 | 66.36,44.45 62.55,44.45 | 62.55,43.18 R36.2 | 43.34,53.66 43.34,49.05 47.94,49.05 48.02,48.97
  Top 0.305: 66.52,47.31 72.71,47.31 74.14,45.88 R8.2 | 90.65,25.56 86.04,25.56 85.57,25.08 U$19.8 | 90.65,25.56 108.43,25.56 108.9,25.08 C3.1 | 53.98,25.72 57.31,25.72 57.71,25.32 | 53.98,25.72 35.24,25.72 34.77,25.24 U$8.8 | 57.71,25.32 58.1,24.92 C12.1 | RPI1.17 14.92,28.57 18.42,25.08 32.86,25.08 C10.1 | 90.65,25.56 90.65,29.69 62.07,29.69 57.71,25.32 | 53.98,25.72 v53.98,29.53
  Bottom 0.305: U$20.1 143.83,25.72 143.83,49.37 v139.86,53.34 | v82.07,53.34 81.76,53.02 v81.76,47.31 | v53.98,45.24 v53.98,43.66 v53.98,29.53 | v66.2,50.96 66.68,50.48 v66.68,49.21 | v89.85,50.64 89.22,50.01 v89.22,44.45
3SCL  (via drill 0.33)
  Top 0.305: v88.27,24.77 89.06,24.77 91.76,22.07 111.44,22.07 112.39,23.02 U$22.4 | v88.27,45.24 87.79,45.72 87.63,45.72 | 87.63,45.72 R16.1 87.31,45.72 | 87.63,45.72 88.74,46.83 89.22,46.83 89.22,47.78 U6.11
  Bottom 0.305: v88.27,45.24 v88.27,24.77
3SDA  (via drill 0.33)
  Top 0.305: v90.17,21.43 113.03,21.43 113.03,23.49 112.71,23.81 112.55,23.81 U$22.3 | v87.47,41.91 87.47,43.18 R15.1 | v88.42,50.01 88.58,50.01 88.58,47.94 U6.10
  Bottom 0.305: v90.17,21.43 87.47,24.13 v87.47,41.91 87.47,45.56 87.95,46.04 87.95,49.53 v88.42,50.01
4.096V
  Top 0.254: U$14.2 28.78,48.69 27.96,48.69 26.67,49.98 26.67,53.34 27.04,53.71 C14.1 C11.1
  Top 0.305: U$77.2 26.99,59.85 26.99,53.82 27.04,53.71
4SCL  (via drill 0.33)
  Top 0.305: 95.49,48.82 92.39,45.72 R18.1 | 95.49,48.82 97.16,50.48 118.59,50.48 U$18.4 | v62.71,55.4 62.71,53.82 U7.14 | v66.04,58.9 66.2,59.05 76.68,59.05 76.84,58.9 v81.28,58.9 | v85.57,51.44 85.88,51.75 88.27,51.75 89.14,52.63 | 89.14,52.63 89.22,52.7 89.22,53.66 U6.14 | 95.49,48.82 94.61,49.69 v94.46,49.69 | v94.46,52.23 94.14,52.55 89.22,52.55 89.14,52.63
  Bottom 0.305: v62.71,55.4 66.04,58.74 v66.04,58.9 | v81.28,58.9 82.55,57.63 82.55,54.45 v85.57,51.44 | v94.46,52.23 v94.46,49.69
4SDA  (via drill 0.33)
  Top 0.305: U$18.3 118.59,49.85 97.79,49.85 91.12,43.18 R17.1 | v70.8,52.86 64.13,52.86 63.34,53.66 U7.13 | v75.72,40 76.99,38.73 89.38,38.73 90.96,40.32 90.96,43.18 R17.1 | v90.65,53.34 90.33,53.34 90.01,53.66 U6.13 | v90.65,44.45 91.44,43.66 R17.1
  Bottom 0.305: v70.8,52.86 71.44,52.23 71.44,44.29 v75.72,40 | v90.65,44.45 v90.65,53.34
5SCL  (via drill 0.33)
  Top 0.305: v63.34,52.39 61.28,52.39 61.28,53.66 U7.16 | v66.68,58.26 66.83,58.1 84.61,58.1 v84.77,58.26 | v87.31,55.24 87.95,54.61 87.95,53.82 U6.16
  Bottom 0.305: v63.34,52.39 66.68,55.72 v66.68,58.26 | v84.77,58.26 87.31,55.72 v87.31,55.24
5SDA  (via drill 0.33)
  Top 0.305: v57.79,56.36 58.74,56.36 59.53,55.56 61.91,55.56 61.91,53.82 U7.15 | v56.36,57.94 56.2,57.78 v52.23,57.78 | v62.39,28.73 62.55,28.89 v89.85,28.89 | v92.23,53.5 91.12,54.61 88.9,54.61 88.58,54.29 88.58,53.82 U6.15
  Bottom 0.305: v57.79,56.36 56.36,57.78 v56.36,57.94 | v52.23,57.78 51.44,56.99 51.44,30.96 53.66,28.73 v62.39,28.73 | v89.85,28.89 92.08,31.11 92.08,53.34 v92.23,53.5
5V  (via drill 0.35)
  Top 0.254: C13.A 139.38,4.13 143.82,8.57 144.14,8.89 147.32,8.89 148.59,10.16 148.59,20.32 148.59,25.4 145.43,28.56 136.9,28.56 136.7,28.75 136.7,32.2 135.89,33.02 134.34,33.02 IC1.4 | C18.1 24.86,60.06 U$77.1
  Top 0.305: 101.76,62.07 J8.1 | 121.28,63.94 121.14,63.8 | J7.1 119.7,62.23 121.21,63.74 121.14,63.8 | 137.32,62.23 J9.1 | 121,63.94 121.14,63.8 | 20.32,60.01 C18.1 | 148.59,20.32 U$59.1 | v24.13,58.42 24.13,59.13 U$77.1
  Top 0.508: 135.6,63.94 121.28,63.94 | 121,63.94 103.38,63.94
  Top 0.61: 101.76,62.07 100.08,60.39 90.14,60.39 89.25,61.28 84.93,61.28 84.14,62.07 J3.1 | 137.32,62.23 135.6,63.94 | 103.38,63.94 101.83,62.39 J8.1 | C13.A 143.82,8.57 147,8.57 148.59,10.16 v148.59,40.64 | J10.1 121.92,7.62 70.81,7.62 64.46,13.97 v53.34,13.97 | v46.99,27.94 43.18,27.94 v41.91,29.21
  Top 1.27: U$83.2 139.06,6.59 C13.A | 139.38,4.13 136.87,1.62 127.92,1.62 J10.1
  Bottom 0.305: 137.32,62.07 J9.1 | 41.91,41.91 41.91,47.18 31.94,57.15 25.4,57.15 v24.13,58.42
  Bottom 0.61: v148.59,40.64 147.32,40.64 144.57,43.39 144.57,49.36 146.13,50.93 146.18,50.93 148.59,53.34 144.78,57.15 144.47,57.15 139.55,62.07 137.32,62.07 | v53.34,13.97 53.34,21.59 v46.99,27.94 | v41.91,29.21 41.91,41.91
6SCL  (via drill 0.33)
  Top 0.305: v60.01,54.77 60.01,53.82 U7.18 | v60.48,56.36 60.64,56.2 85.25,56.2 86.68,54.77 86.68,53.82 U6.18
  Bottom 0.305: v60.01,54.77 60.48,55.24 v60.48,56.36
6SDA  (via drill 0.33)
  Top 0.305: v61.12,54.77 60.64,54.29 60.64,53.82 U7.17 | v75.72,33.18 80.01,37.46 90.01,37.46 v93.66,41.12 | v87.95,52.55 87.31,53.18 87.31,53.66 U6.17
  Bottom 0.305: v61.12,54.77 61.28,54.93 61.28,56.36 65.56,60.64 67.47,60.64 67.47,36.51 70.96,33.02 75.72,33.02 v75.72,33.18 | v93.66,41.12 93.66,53.34 92.08,54.93 87.95,54.93 v87.95,52.55
7SCL  (via drill 0.33)
  Top 0.305: v54.77,56.36 56.2,56.36 56.99,55.56 58.74,55.56 58.74,53.82 U7.20 | v54.93,40.32 55.72,39.53 61.75,39.53 62.07,39.85 v69.06,39.85 | v69.22,55.24 69.53,55.56 79.53,55.56 80.65,54.45 80.65,52.55 84.77,52.55 85.41,53.18 85.41,53.66 U6.20
  Bottom 0.305: v54.77,56.36 53.66,55.24 53.66,47.47 54.13,46.99 54.13,46.35 54.93,45.56 v54.93,40.32 | v69.06,39.85 69.22,40 v69.22,55.24
7SDA  (via drill 0.33)
  Top 0.305: v63.34,50.32 61.91,51.75 59.37,51.75 59.37,53.66 U7.19 | v63.98,38.26 68.58,38.26 72.39,42.07 v74.77,42.07 | v80.8,51.75 80.96,51.91 84.93,51.91 86.04,53.02 86.04,53.66 U6.19
  Bottom 0.305: v63.34,50.32 63.98,49.69 63.98,42.55 64.13,42.39 64.13,38.42 v63.98,38.26 | v74.77,42.07 75.72,43.02 75.72,44.93 78.26,47.47 80.01,47.47 80.01,50.96 v80.8,51.75
11SCL  (via drill 0.33)
  Top 0.305: v59.85,49.05 60.01,49.05 60.01,47.94 U7.7 | v57.79,46.2 57.31,45.72 R32.1
  Bottom 0.305: v57.79,46.2 57.79,46.99 v59.85,49.05 59.69,49.05 59.53,49.21 59.53,54.13 59.21,54.45 59.21,57.47 59.37,57.63 59.37,61.91 61.59,64.13 76.99,64.13 76.99,62.23 J3.3
11SDA  (via drill 0.33)
  Top 0.305: v59.53,46.83 59.37,46.83 59.37,47.78 U7.6 | v57.79,44.13 56.83,43.18 R31.1 | v61.44,40.32 61.59,40.48 67.94,40.48 v70.01,42.55
  Bottom 0.305: v59.53,46.83 57.79,45.09 v57.79,44.13 61.44,40.48 v61.44,40.32 | v70.01,42.55 70.01,58.58 73.5,62.07 J3.4
12V  (via drill 0.35)
  Top 0.305: 3.48,11.43 J1.1 | U$40.1 147.64,17.78 147.64,13.97 147.32,13.65 146.69,13.65 145.89,12.86 R12.2 | SP2.1 110.49,48.1 111.92,46.67 119.38,46.67 126.84,39.21 127.1,39.03
  Top 0.406: 22.86,30.48 20.32,30.48 15.53,35.27 15.33,35.06 14.29,35.06 13.57,35.79 13.57,36.77 12.74,37.6 11.75,37.6 9.99,39.37 J4.1 2.54,44.06 0.93,45.67 0.93,50.51 2.54,52.12 J6.1 | v17.78,13.97 17.78,11.43 16.05,11.43 15.33,12.15 11.75,12.15 11.03,11.43 J1.1 0.93,13.04 0.93,22.57 1.27,22.91 1.27,24.13 J2.1 | v25.4,29.21 26.67,30.48
  Top 0.813: C1.+ 127.1,39.03 127.1,35.21 122.37,30.48 26.67,30.48 22.86,30.48
  Top 1.27: IC1.1 136.2,39.98 136.2,40.04 136.69,40.53 137.05,40.53 141.24,44.72 J5.PWR C1.+ 135.89,48.26
  Bottom 0.305: U$40.1 141.29,20 141.29,48.26 J5.PWR
  Bottom 0.406: v17.78,13.97 18.89,13.97 25.4,20.48 v25.4,29.21
22SCL  (via drill 0.33)
  Top 0.305: 61.28,45.72 61.28,47.78 U7.9 | R34.1 61.28,45.72 | v61.59,45.4 61.28,45.72 | v62.39,38.26 67.63,33.02 74.45,33.02 79.53,38.1 89.53,38.1 v95.41,43.97
  Bottom 0.305: v61.59,45.4 62.39,44.61 v62.39,38.26 | v95.41,43.97 95.25,44.13 95.25,61.75 94.93,62.07 J8.3
22SDA  (via drill 0.33)
  Top 0.305: v60.8,49.05 60.64,49.05 60.64,47.94 U7.8 | v60.8,44.45 60.8,43.18 R33.1 | 66.01,59.98 v65.88,59.85 76.36,59.85 76.9,60.39 77.76,60.39 77.95,60.2 88.96,60.2 v89.19,59.98
  Bottom 0.305: v60.8,44.45 v60.8,49.05 60.8,53.34 61.91,54.45 61.91,55.88 v65.88,59.85 | v89.19,59.98 91.28,62.07 J8.4
33SCL  (via drill 0.33)
  Top 0.305: v62.71,49.05 62.71,47.94 U7.11 | v63.34,42.07 64.45,43.18 R36.1
  Bottom 0.305: v62.71,49.05 63.34,48.42 v63.34,42.07 63.18,41.91 63.18,20.48 64.45,19.21 93.82,19.21 93.82,21.91 125.25,53.34 125.25,62.86 126.21,63.82 130.33,63.82 130.33,62.23 J9.3
33SDA  (via drill 0.33)
  Top 0.305: U7.10 62.07,47.78 62.07,46.83 63.18,46.83 64.29,45.72 R35.1 64.45,45.72 64.93,45.24 v65.41,45.24 | v93.19,22.86 95.09,24.77 v97.79,24.77
  Bottom 0.305: v65.41,45.24 65.72,44.93 65.72,21.27 66.52,20.48 93.19,20.48 v93.19,22.86 | v97.79,24.77 126.84,53.82 126.84,62.07 J9.4
A0_PC  (via drill 0.33)
  Top 0.305: v54.93,47.15 55.4,47.15 56.04,47.78 U7.1 | v54.45,50.16 54.45,51.44 R39.1 | v78.9,50.64 78.9,51.59 79.53,51.59 R19.1 | U6.1 82.71,47.94 82.39,48.26 v79.22,48.26 78.58,47.62 73.5,47.62 73.18,47.94 68.9,47.94 v68.42,48.42 | v55.56,58.58 55.72,58.74 v60.33,58.74
  Bottom 0.305: v54.93,47.15 54.45,47.62 v54.45,50.16 55.56,51.28 v55.56,58.58 | v79.22,48.26 78.9,48.58 v78.9,50.64 | v60.33,58.74 62.87,58.74 65.41,61.28 68.42,61.28 v68.42,48.42
A1_PC  (via drill 0.33)
  Top 0.305: 56.67,49.37 56.67,47.94 U7.2 | 56.67,49.37 51.28,49.37 50.48,50.16 R40.1 | 76.28,50.4 75.88,50.8 R20.1 | 76.28,50.4 76.84,49.85 81.12,49.85 81.92,49.05 83.34,49.05 83.34,47.94 U6.2 | 56.67,49.37 58.26,50.96 v61.59,50.96 | v64.45,54.61 64.61,54.45 v73.34,54.45 | 76.28,50.4 v76.84,50.96
  Bottom 0.305: v61.59,50.96 62.55,51.91 62.55,52.7 v64.45,54.61 | v76.84,50.96 v73.34,54.45
A2_PC  (via drill 0.33)
  Top 0.305: U7.21 58.1,53.66 58.1,52.86 55.09,52.86 54.45,53.5 R41.1 54.29,53.5 53.34,52.55 v49.85,52.55 | v84.93,55.4 84.77,55.4 84.77,53.82 U6.21 | v78.74,52.86 79.69,53.82 R25.1 | v43.18,32.23 43.34,32.38 56.04,32.38 59.21,35.56 v63.98,35.56 | v76.84,53.66 v66.68,53.66
  Bottom 0.305: v84.93,55.4 83.98,56.36 83.98,59.21 82.23,60.96 82.23,62.86 81.28,63.82 78.74,63.82 78.74,55.88 77.95,55.09 77.95,53.66 | v78.74,52.86 77.95,53.66 | v49.85,52.55 43.18,45.88 v43.18,32.23 | v63.98,35.56 64.77,36.35 64.77,44.77 64.61,44.93 64.61,51.59 v66.68,53.66 | 77.95,53.66 v76.84,53.66
ADC1  (via drill 0.33)
  Top 0.305: v11.43,42.7 17.62,42.7 18.1,43.18 R26.2
  Bottom 0.305: v11.43,42.7 5.4,36.67 5.4,7.3 2.54,4.45 J1.3
ADC2  (via drill 0.33)
  Top 0.305: v11.43,47.78 17.3,47.78 18.1,46.99 R28.2
  Bottom 0.305: v11.43,47.78 4.76,41.12 4.76,20.64 2.54,18.41 J2.3
ADC3  (via drill 0.33)
  Top 0.305: v4.13,42.7 11.75,50.32 17.62,50.32 18.1,50.8 R27.2
  Bottom 0.305: v4.13,42.7 4.13,33.97 2.54,32.38 J4.3
ADC4
  Top 0.305: R37.2 18.1,54.61 16.35,52.86 9.05,52.86 2.54,46.35 J6.3
GND  (via drill 0.33, 0.35)
  Top 0.254: C15.2 C9.2 33.02,55.51 | 33.02,55.51 C11.2 C14.2 | U$14.3 29.02,48.03 29.84,48.03 30.27,48.47 | 30.27,48.47 30.48,48.68 30.48,49.53 | U$14.1 29.22,49.53 30.48,49.53 | U$14.12 32.12,46.61 30.27,48.47 | 33.02,55.51 33.02,52.07 30.48,49.53 | U7.12 63.27,48.34 C8.2 | U6.12 91.65,49.6 C7.2 | U$18.7 120.01,49.06 119.77,49.06 119.38,48.67 | 119.38,48.67 119.38,48.26 119.56,48.26 119.77,48.05 121.34,48.05 C6.2 | U$18.1 119.27,48.55 119.38,48.67 | U$22.1 112.26,24.96 112.02,24.96 111.51,24.45 | U$22.7 111.51,24.45 | 111.51,24.45 111.43,24.38 111.43,22.84 111.24,22.65 110.47,22.65 109.89,23.23 C3.2 | U$19.1 86.86,24.83 86.62,24.83 86.11,24.33 U$19.7 85.6,24.18 85.84,24.18 86.03,23.99 86.03,22.72 85.84,22.52 85.07,22.52 84.36,23.23 C2.2 | U$9.1 61.46,24.83 61.22,24.83 60.71,24.33 | U$9.7 60.71,24.33 | 60.71,24.33 60.63,24.25 60.63,22.72 60.44,22.52 59.67,22.52 59.09,23.1 C12.2 | U$8.1 36.06,24.96 35.82,24.96 35.31,24.45 U$8.7 34.8,24.31 35.04,24.31 35.23,24.12 35.23,22.84 35.04,22.65 34.27,22.65 33.69,23.23 C10.2 | C18.2 20.52,62.06 U$77.3
  Top 0.305: v116.68,45.88 116.68,43.02 Q2.2 | C8.2 64.77,50.01 64.93,50.16 73.34,50.16 73.98,50.8 R20.2 74.14,50.8 75.25,51.91 77.63,51.91 77.79,51.75 R19.2 77.79,51.91 77.79,53.82 R25.2 77.95,53.97 v78.74,54.77 | v96.04,50.48 92.71,50.48 91.92,49.69 C7.2 | J3.2 80.65,62.23 82.23,63.82 96.68,63.82 98.27,62.23 J8.2 | 25.08,46.99 25.08,43.18 C4.2 | 25.08,50.8 25.08,54.61 C17.2 | 25.08,50.8 25.08,47.94 | 25.08,47.94 25.08,46.99 | 25.08,46.99 C16.2 | 25.08,50.8 C5.2 | R39.2 50.01,51.44 48.74,50.16 R40.2 48.58,50.16 47.94,50.8 v44.13,50.8 | v40.32,54.61 39.53,55.4 39.37,55.4 C15.2 | 25.08,47.94 28.89,47.94 U$14.3 | C18.2 20.32,61.75 15.24,56.67 14.92,56.67 RPI1.39 | D2.C 146.53,14.92 144.78,16.67 139.38,16.67 138.99,17.07 | C6.2 121.92,48.58 127.32,48.58 C1.- | 34.29,15.57 34.29,22.54 34.27,22.65 | C2.2 83.5,23.18 76.52,16.19 76.52,15.57 | C12.2 58.1,23.18 56.2,25.08 36.35,25.08 U$8.1 | 113.67,15.57 113.67,24.13 112.71,25.08 112.55,25.08 U$22.1 | 139.7,22.86 U$31.1 | J4.2 | 140.57,55.48 143.19,52.86 143.35,52.86 J5.GNDBREAK | 140.57,55.48 135.33,60.72 | 135.33,60.72 133.99,62.07 J9.2 | J2.2 | 140.57,55.48 U$66.1 | C14.2 29.21,61.91 26.04,61.91 U$77.3 | J7.2 116.2,62.07 117.63,60.64 135.25,60.64 135.33,60.72
  Top 0.406: J4.2 8.89,35.88 | 10.16,21.91 J2.2 | RPI1.30 10.32,45.88 10.32,48.1 11.22,49.01 RPI1.34 | v10.67,40.13 10.68,40.14 12.79,40.14 12.99,40.35 13.31,40.35 RPI1.25
  Top 0.813: 10.16,35.88 8.89,35.88 v8.89,38.1
  Top 1.27: 140.97,34.29 IC1.6 | IC1.6 143.51,34.29 143.51,33.02 142.24,33.02 140.97,34.29 | 140.97,34.29 140.97,35.56 142.24,35.56 | 142.24,35.56 143.51,35.56 IC1.6 | 140.97,34.29 IC1.3 132.08,34.29 131.96,34.17 131.96,30.48 | C13.C 132.08,3.81 129.54,6.35 129.54,12.7 | 129.54,12.7 133.35,16.51 138.43,16.51 138.99,17.07 139.7,17.78 139.7,22.86 134.62,27.94 131.96,27.94 | 131.96,27.94 D1.A | 131.96,27.94 131.96,30.48 | 131.96,30.48 132.37,30.89 IC1.5 | C1.- 128.27,48.26 132.08,52.07 143.35,52.07 J5.GNDBREAK 147.24,49.96 J5.GND 147.24,41.83 142.24,36.83 142.24,35.56 | 129.54,12.7 127.78,12.7 124.91,15.57 113.67,15.57 76.52,15.57 34.29,15.57 19.99,15.57 17.03,18.53 RPI1.9
  Bottom 0.305: v116.68,45.88 116.2,46.35 116.2,54.29 | 116.2,54.29 116.2,62.07 J7.2 | v96.04,50.48 98.27,52.7 98.27,54.29 | 98.27,54.29 98.27,62.07 J8.2 | v78.74,54.77 80.49,56.52 80.49,62.07 J3.2 | 98.27,54.29 116.2,54.29 | v40.32,54.61 v44.13,50.8 | 2.54,21.75 J2.2 | 12.22,49.69 12.22,49.05 RPI1.34 | 2.54,49.69 J6.2 | U$63.1 144.62,5.24 144.62,21.75 U$31.1
  Bottom 0.406: J1.2 2.42,7.93 0.83,9.52 0.83,20.03 2.54,21.75 | 12.22,49.69 2.54,49.69
  Bottom 0.813: RPI1.39 14.32,56.63 12.87,58.08 11.67,58.08 10.16,56.57 10.16,50.8 11.95,49.01 RPI1.34 | v8.89,38.1 10.67,39.88 v10.67,40.13
  pour Top (isolate 0.254, no thermals): 12.7,12.7 10.16,12.7 10.16,58.42 16.51,58.42 16.51,12.7
GPIO12  (via drill 0.33)
  Top 0.305: v57.15,32.38 86.84,32.38 95.09,40.64 120.65,40.64 120.65,43.5 119.7,44.45 R24.2 | v54.77,34.77 48.42,41.12 20.48,41.12 19.05,42.55 19.05,45.24 13.49,45.24 12.38,46.35 RPI1.32
  Bottom 0.305: v54.77,34.77 v57.15,32.38
N$2
  Top 0.305: R12.1 143.99,12.86 143.99,14.76 143.67,14.76 D2.A
N$9
  Top 0.305: Q2.3 115.73,45.09 114.78,46.04 106.05,46.04 103.98,48.1 SP2.2
N$10
  Top 0.305: Q2.1 114.94,42.86 115.73,42.07 118.9,42.07 119.54,42.7 R24.1
N$18
  Top 0.254: R26.1 C4.1
  Top 0.305: U$14.4 29.05,47.31 29.84,47.31 30.16,46.99 30.16,42.07 24.45,42.07 23.34,43.18 C4.1
N$19  (via drill 0.33)
  Top 0.254: R27.1 C5.1
  Top 0.305: v25.88,45.72 26.19,45.72 26.51,46.04 28.89,46.04 U$14.6 | v23.34,49.53 23.34,50.8 C5.1
  Bottom 0.305: v25.88,45.72 24.92,45.72 24.45,45.24 23.34,45.24 v23.34,49.53
N$20  (via drill 0.33)
  Top 0.254: R28.1 23.18,46.99
  Top 0.305: v26.04,46.67 28.89,46.67 U$14.5 | v24.13,46.04 23.18,46.99 C16.1
  Bottom 0.305: v26.04,46.67 24.13,46.67 v24.13,46.04
N$21
  Top 1.27: IC1.2 131.24,35.99 129.54,34.29 129.54,29.21 127,26.67 127,22.86 129.54,20.32 135.03,20.32 U$83.1 135.14,19.8 135.89,19.05 135.89,23.23 D1.C
N$22  (via drill 0.33)
  Top 0.254: R37.1 23.18,54.61
  Top 0.305: v27.46,45.24 28.89,45.24 U$14.7 | v24.13,53.66 23.18,54.61 C17.1
  Bottom 0.305: v27.46,45.24 26.83,45.88 26.83,50.96 v24.13,53.66
N$23
  Top 0.305: R38.2 39.85,48.58 39.21,49.21 34.92,49.21 U$14.16
N$24
  Top 0.305: R43.2 39.69,46.51 37.62,48.58 34.92,48.58 U$14.15
N$25
  Top 0.305: R44.2 39.69,44.45 36.2,47.94 34.92,47.94 U$14.14
PI_POWER
  Top 0.406: 15.05,6.66 15.74,5.97 16.51,5.97 16.51,6.35 16.51,8.43 15.33,9.61 14.29,9.61 13.05,8.37 RPI1.2 12.27,7.23 12.7,6.8 14.86,6.8 | 15.05,6.66 14.91,6.8 | 14.91,6.8 14.86,6.8 | 14.91,6.8 15.05,6.66 | 15.05,6.66 15.3,6.41 15.25,6.41 arc-90 14.86,6.8 | 15.05,6.66 arc-90 15.05,6.66
  Top 0.61: 12.91,8.37 RPI1.2
  Top 1.27: RPI1.4 RPI1.2 | J10.2 66.24,5.08 64.09,7.23 60.99,7.23 60.11,6.35 16.51,6.35
  pour Top (isolate 0.254, no thermals): 10.67,10.79 16.26,10.79 16.26,5.08 10.54,5.08 10.54,10.79
RESET  (via drill 0.33)
  Top 0.305: v80.96,50.64 81.12,50.64 82.07,49.69 83.98,49.69 83.98,47.94 U6.3 | v80.8,49.05 76.2,49.05 75.88,48.74 R6.2 | v57.47,49.05 57.47,47.94 U7.3 | v55.25,48.1 55.09,47.94 51.91,47.94 50.96,46.99 49.69,46.99 48.74,47.94 R42.2 | v62.39,31.59 v80.17,31.59
  Bottom 0.305: v80.96,50.64 80.8,50.48 v80.8,49.05 80.65,48.89 80.65,40.8 80.17,40.32 v80.17,31.59 | v57.47,49.05 56.99,48.58 56.99,39.21 57.15,39.05 57.15,38.42 56.75,38.02 | 56.75,38.02 56.67,37.94 55.56,37.94 55.56,39.85 55.72,40 55.72,47.62 v55.25,48.1 | v62.39,31.59 56.83,37.15 56.83,37.94 56.75,38.02
SCL  (via drill 0.33)
  Top 0.305: v57.47,54.77 57.47,53.82 U7.22 | v56.36,38.73 56.52,38.89 60.01,38.89 | 60.01,38.89 61.91,38.89 62.07,39.05 v68.26,39.05 | 68.26,43.18 v68.26,41.91 | v81.44,54.45 82.55,55.56 84.14,55.56 84.14,53.82 U6.22 | v72.23,45.24 70.33,43.34 68.42,43.34 68.26,43.18 | 68.26,43.18 R22.1 | v22.23,31.27 23.97,33.02 54.13,33.02 60.01,38.89
  Bottom 0.305: v57.47,54.77 56.36,53.66 v56.36,38.73 | v68.26,41.91 v68.26,39.05 | v72.23,45.24 v81.44,54.45 | v22.23,31.27 22.23,20.8 14.92,13.49 RPI1.5
SDA  (via drill 0.33)
  Top 0.305: v50.64,55.24 55.4,55.24 55.56,55.09 56.67,55.09 56.67,53.82 U7.23 | v50.64,41.91 51.28,41.27 66.04,41.27 67.31,42.55 67.31,45.72 R21.1 71.44,45.72 v72.23,46.51 | v83.34,54.77 83.34,53.82 U6.23 | v83.19,58.9 82.39,59.69 v77.47,59.69
  Bottom 0.305: v50.64,55.24 v50.64,41.91 50.8,41.75 50.8,35.4 43.18,27.78 43.18,7.62 18.1,7.62 14.92,10.79 RPI1.3 | v83.34,54.77 83.19,54.93 v83.19,58.9 | v77.47,59.69 72.23,54.45 v72.23,46.51
SPI_MISO  (via drill 0.33)
  Top 0.305: v40.64,45.56 41.43,46.35 R43.1
  Bottom 0.305: v40.64,45.56 39.53,45.56 26.99,33.02 14.92,33.02 14.92,33.66 RPI1.21
SPI_MOSI  (via drill 0.33)
  Top 0.305: v36.99,41.91 38.89,41.91 41.43,44.45 R44.1
  Bottom 0.305: v36.99,41.91 36.67,41.91 26.83,32.07 14.92,32.07 14.92,31.27 RPI1.19
SPI_SCLK  (via drill 0.33)
  Top 0.305: v40.64,47.47 41.59,48.42 R38.1
  Bottom 0.305: v40.64,47.47 33.81,40.64 16.03,40.64 16.03,37.46 14.92,36.35 RPI1.23

### Text on the board
tPlace: Sensirion Sensors #1-4 | 1 | 5V | 5V | 5V | 5V | MAF / Sensors / #1-4 | GND | GND | GND | GND | 1SDA | 1SCL | 1SDA | 1SCL | 1SDA | 1SCL | 1SDA | 1SCL | 2 | 3 | 4 | 12V | PCA9548 | PCA9548 | BUZZ | GND | 5 | 4 | ADC4 | 5V Reg | 12V | GND | 3 | ADC3 | 12V | 3V | GND | GND | 2 | 5V | ADC2 | 12V | 12V | 1 | 1 | 3 | 4 | GND | 2 | 5V | ADC1 | Pressure Sensor and Airflow Sensor PI Hat / Project Tetra / Thomas H. 6/10/20 v0.00.001 | Jumper / 5V to PI